# EAGLE schematic RFID_SHIELD (EAGLE 8.0.1)
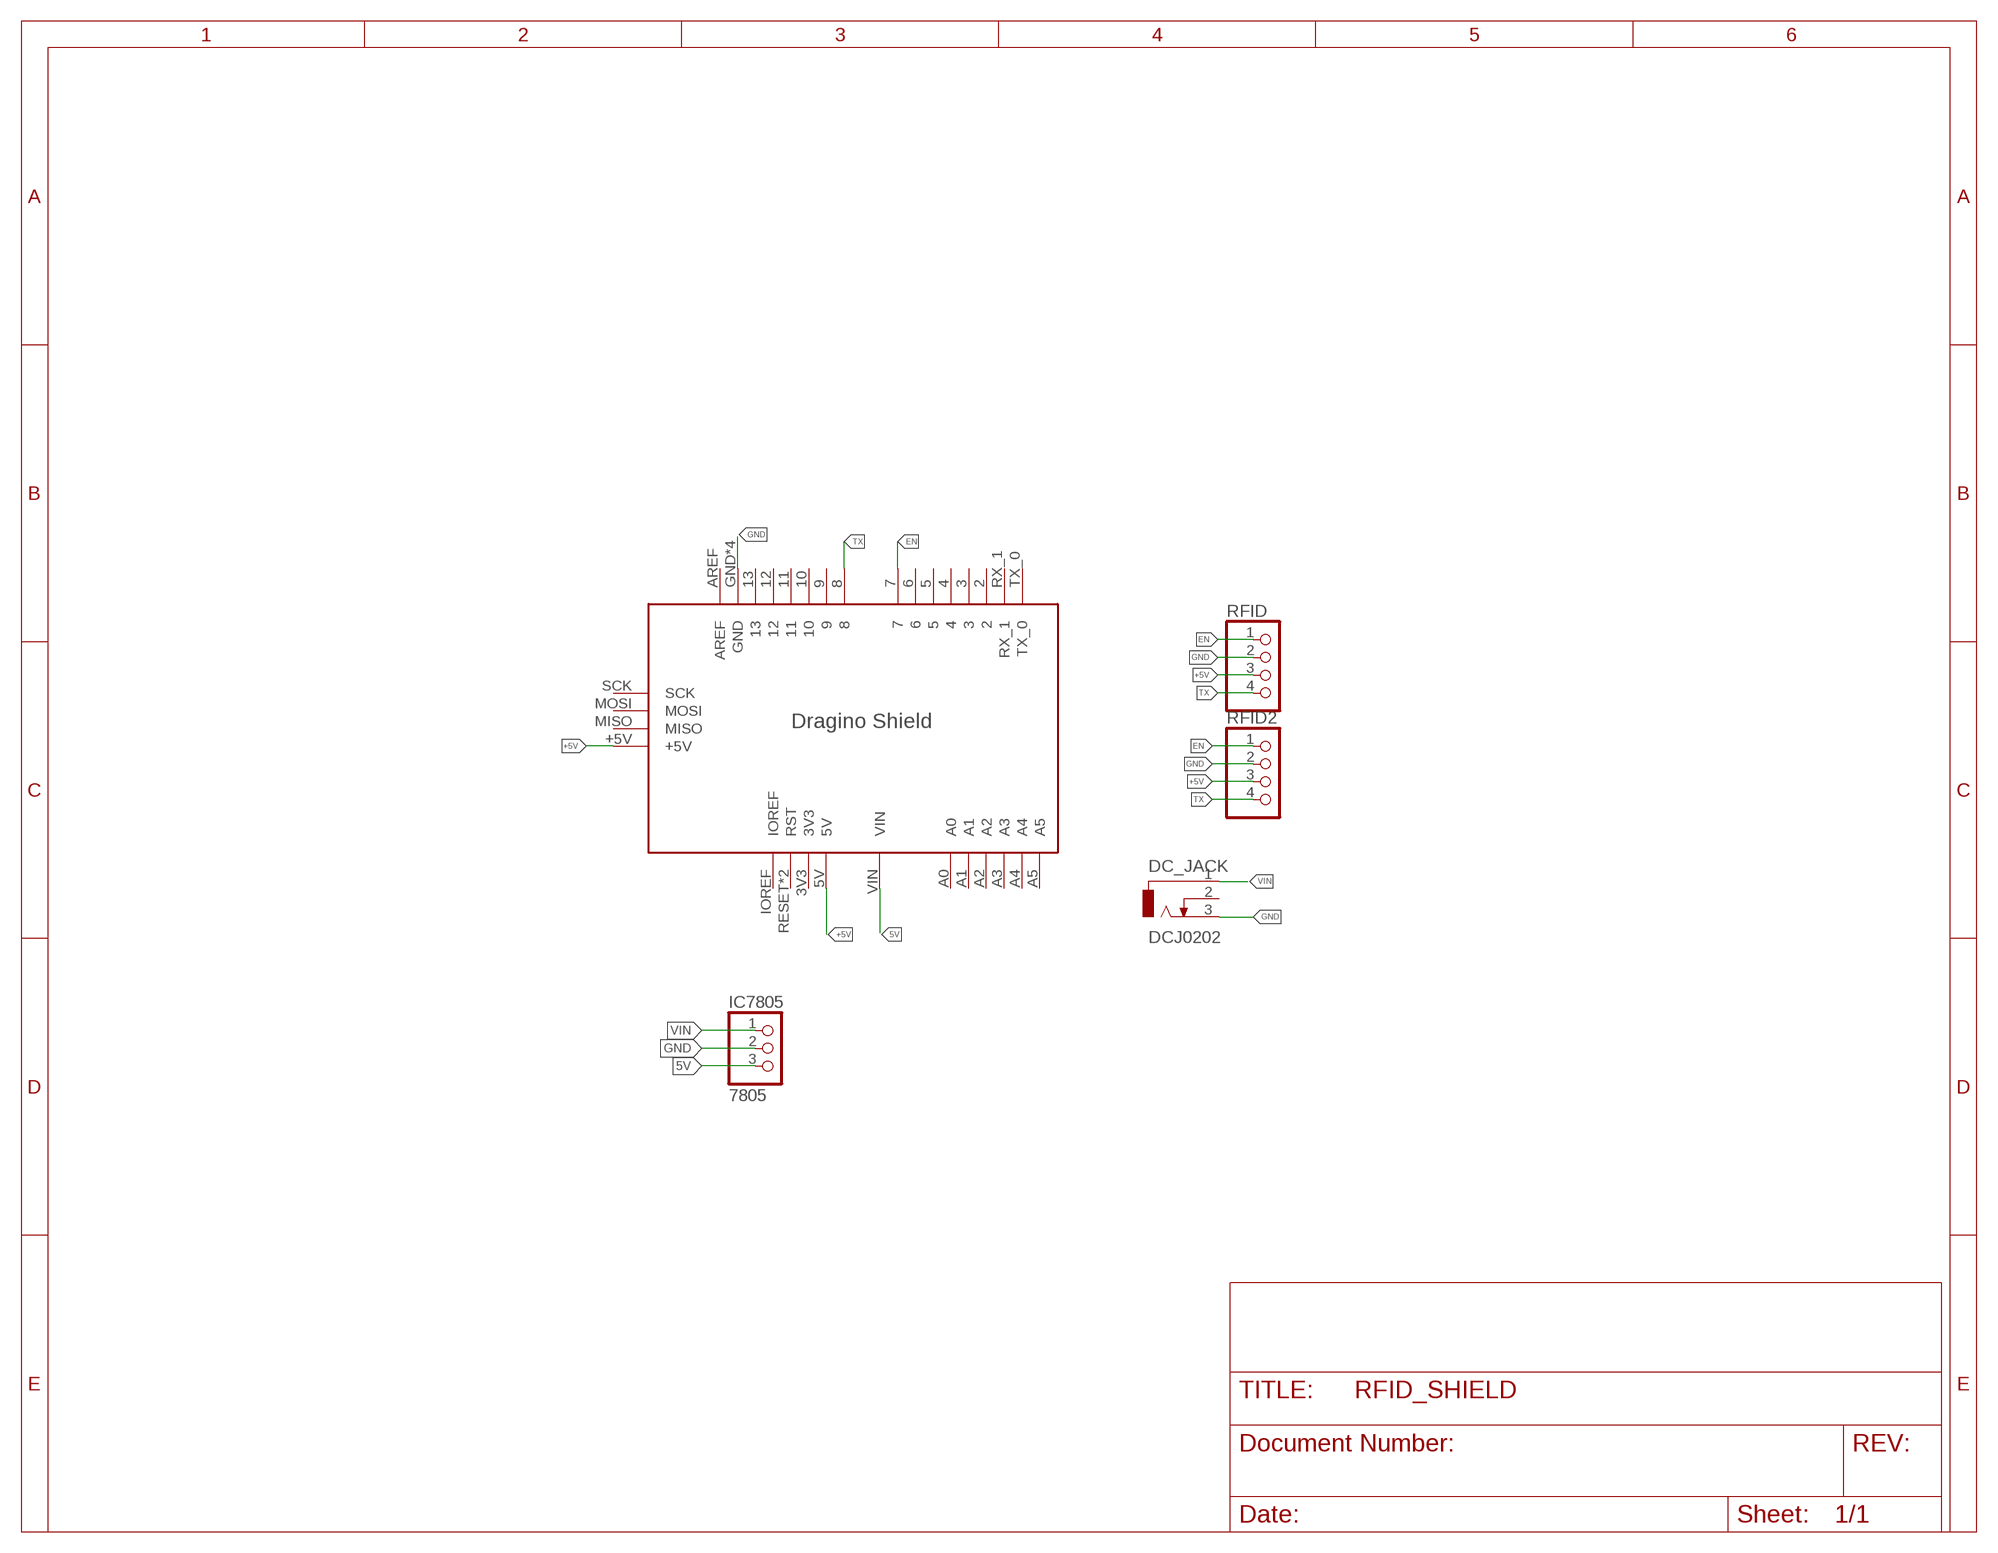
[diagram p0: schematic, sheet 1]

## Parts
DC_JACK  DCJ0202  [DCJ0202]
IC7805  7805  PINHD-1X3  [1X03]
RFID  PINHD-1X4  [1X04]
RFID2  PINHD-1X4  [1X04]
U$1  DRAGINO_SHIELD  [DRAGINO_SHIELD]

## Nets
5V: IC7805.3 U$1.VIN
+5V: RFID2.3 RFID.3 U$1.5V U$1.+5V
EN: RFID2.1 RFID.1 U$1.7
GND: DC_JACK.3 IC7805.2 RFID2.2 RFID.2 U$1.GND U$1.GND@1(GND) U$1.GND@2(GND) U$1.GND@3(GND)
TX: RFID2.4 RFID.4 U$1.8
VIN: DC_JACK.1 IC7805.1
Unconnected: DC_JACK.2 U$1.2 U$1.3 U$1.3V3 U$1.4 U$1.5 U$1.6 U$1.9 U$1.10 U$1.11 U$1.12 U$1.13 U$1.A0 U$1.A1 U$1.A2 U$1.A3 U$1.A4 U$1.A5 U$1.AREF U$1.IOREF U$1.MISO U$1.MOSI U$1.RESET(RST) U$1.RST U$1.RX_1 U$1.SCK U$1.TX_0

## Library data of the parts
DC_JACK = con-jack:DCJ0202: DC POWER JACK Source: DCJ0202.pdf; OC_FARNELL: unknown; OC_NEWARK: unknown
IC7805 = pinhead:PINHD-1X3: PIN HEADER
RFID RFID2 = pinhead:PINHD-1X4: PIN HEADER
U$1 = Dragino_shield:DRAGINO_SHIELD